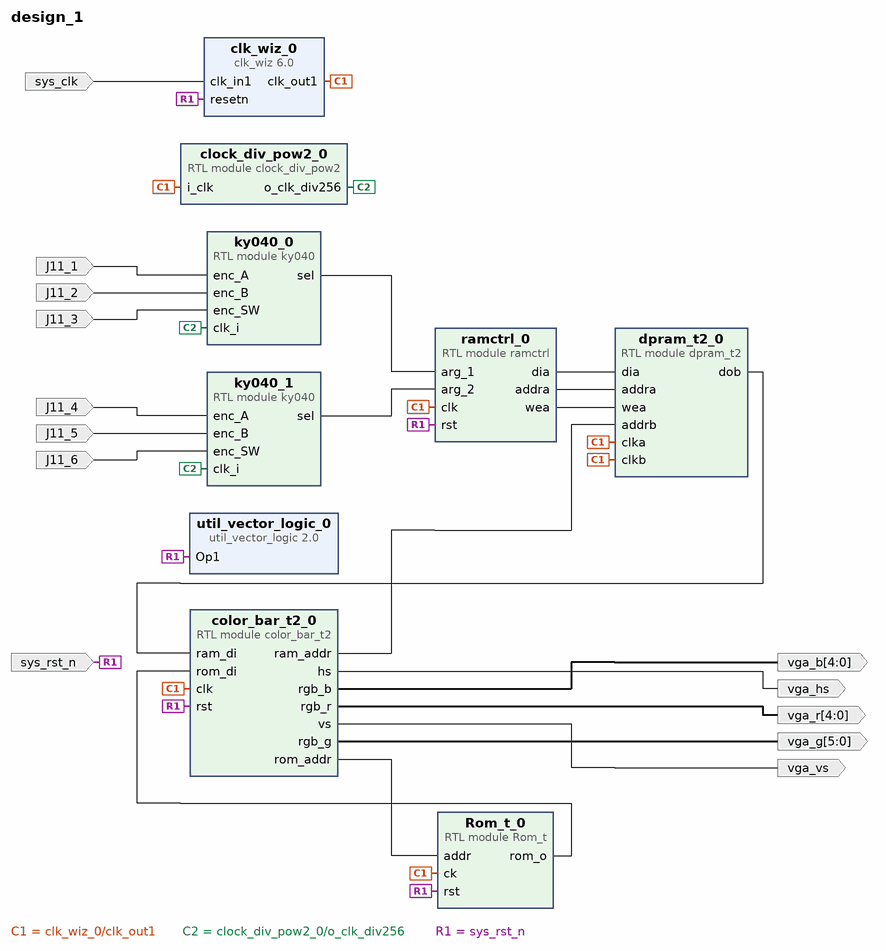
[diagram p0: block diagram of the top level]
# Vivado block design design_1, xc7k325tffg676-1, Vivado 2019.1
create_bd_design design_1

create_bd_port -dir I sys_clk
create_bd_port -dir I sys_rst_n
create_bd_port -dir I J11_1
create_bd_port -dir I J11_2
create_bd_port -dir I J11_3
create_bd_port -dir I J11_4
create_bd_port -dir I J11_5
create_bd_port -dir I J11_6
create_bd_port -dir O vga_hs
create_bd_port -dir O vga_vs
create_bd_port -dir O -from 4 -to 0 vga_r
create_bd_port -dir O -from 4 -to 0 vga_b
create_bd_port -dir O -from 5 -to 0 vga_g

create_bd_cell -type module -reference clock_div_pow2 clock_div_pow2_0
create_bd_cell -type ip -vlnv xilinx.com:ip:clk_wiz:6.0 clk_wiz_0
set_property -dict [list \
  CONFIG.CLKIN1_JITTER_PS 200.0 \
  CONFIG.CLKOUT1_JITTER 159.601 \
  CONFIG.CLKOUT1_PHASE_ERROR 161.614 \
  CONFIG.CLKOUT1_REQUESTED_OUT_FREQ 150.000 \
  CONFIG.CLKOUT2_JITTER 175.200 \
  CONFIG.CLKOUT2_PHASE_ERROR 161.614 \
  CONFIG.CLKOUT2_USED true \
  CONFIG.CLKOUT3_JITTER 247.377 \
  CONFIG.CLKOUT3_PHASE_ERROR 161.614 \
  CONFIG.CLKOUT3_REQUESTED_OUT_FREQ 25.000 \
  CONFIG.CLKOUT3_USED true \
  CONFIG.MMCM_CLKFBOUT_MULT_F 18.000 \
  CONFIG.MMCM_CLKIN1_PERIOD 20.000 \
  CONFIG.MMCM_CLKIN2_PERIOD 10.0 \
  CONFIG.MMCM_CLKOUT0_DIVIDE_F 6.000 \
  CONFIG.MMCM_CLKOUT1_DIVIDE 9 \
  CONFIG.MMCM_CLKOUT2_DIVIDE 36 \
  CONFIG.NUM_OUT_CLKS 3 \
  CONFIG.PRIM_IN_FREQ 50.000 \
  CONFIG.RESET_PORT resetn \
  CONFIG.RESET_TYPE ACTIVE_LOW \
] [get_bd_cells clk_wiz_0]
create_bd_cell -type module -reference ky040 ky040_0
create_bd_cell -type module -reference ky040 ky040_1
create_bd_cell -type ip -vlnv xilinx.com:ip:util_vector_logic:2.0 util_vector_logic_0
set_property -dict {CONFIG.C_OPERATION not CONFIG.C_SIZE 1} [get_bd_cells util_vector_logic_0]
create_bd_cell -type module -reference dpram_t2 dpram_t2_0
create_bd_cell -type module -reference ramctrl ramctrl_0
create_bd_cell -type module -reference Rom_t Rom_t_0
create_bd_cell -type module -reference color_bar_t2 color_bar_t2_0

# ---- connections ----

connect_bd_net [get_bd_ports sys_clk] [get_bd_pins clk_wiz_0/clk_in1]
connect_bd_net [get_bd_pins clk_wiz_0/clk_out1] \
  [get_bd_pins clock_div_pow2_0/i_clk] [get_bd_pins dpram_t2_0/clka] [get_bd_pins dpram_t2_0/clkb] \
  [get_bd_pins ramctrl_0/clk] [get_bd_pins Rom_t_0/ck] [get_bd_pins color_bar_t2_0/clk]
connect_bd_net [get_bd_pins ky040_1/sel] [get_bd_pins ramctrl_0/arg_2]
connect_bd_net -net J11_1_1 [get_bd_ports J11_1] [get_bd_pins ky040_0/enc_A]
connect_bd_net -net J11_2_1 [get_bd_ports J11_2] [get_bd_pins ky040_0/enc_B]
connect_bd_net -net J11_3_1 [get_bd_ports J11_3] [get_bd_pins ky040_0/enc_SW]
connect_bd_net -net J11_4_1 [get_bd_ports J11_4] [get_bd_pins ky040_1/enc_A]
connect_bd_net -net J11_5_1 [get_bd_ports J11_5] [get_bd_pins ky040_1/enc_B]
connect_bd_net -net J11_6_1 [get_bd_ports J11_6] [get_bd_pins ky040_1/enc_SW]
connect_bd_net [get_bd_pins clock_div_pow2_0/o_clk_div256] [get_bd_pins ky040_0/clk_i] [get_bd_pins ky040_1/clk_i]
connect_bd_net [get_bd_pins ky040_0/sel] [get_bd_pins ramctrl_0/arg_1]
connect_bd_net [get_bd_pins ramctrl_0/dia] [get_bd_pins dpram_t2_0/dia]
connect_bd_net [get_bd_pins ramctrl_0/addra] [get_bd_pins dpram_t2_0/addra]
connect_bd_net [get_bd_pins ramctrl_0/wea] [get_bd_pins dpram_t2_0/wea]
connect_bd_net [get_bd_ports sys_rst_n] \
  [get_bd_pins util_vector_logic_0/Op1] [get_bd_pins clk_wiz_0/resetn] [get_bd_pins ramctrl_0/rst] [get_bd_pins Rom_t_0/rst] \
  [get_bd_pins color_bar_t2_0/rst]
connect_bd_net [get_bd_pins color_bar_t2_0/ram_addr] [get_bd_pins dpram_t2_0/addrb]
connect_bd_net [get_bd_pins Rom_t_0/rom_o] [get_bd_pins color_bar_t2_0/rom_di]
connect_bd_net [get_bd_pins dpram_t2_0/dob] [get_bd_pins color_bar_t2_0/ram_di]
connect_bd_net [get_bd_pins color_bar_t2_0/rom_addr] [get_bd_pins Rom_t_0/addr]
connect_bd_net [get_bd_pins color_bar_t2_0/hs] [get_bd_ports vga_hs]
connect_bd_net [get_bd_pins color_bar_t2_0/rgb_r] [get_bd_ports vga_r]
connect_bd_net [get_bd_pins color_bar_t2_0/vs] [get_bd_ports vga_vs]
connect_bd_net [get_bd_pins color_bar_t2_0/rgb_b] [get_bd_ports vga_b]
connect_bd_net [get_bd_pins color_bar_t2_0/rgb_g] [get_bd_ports vga_g]

validate_bd_design
save_bd_design
